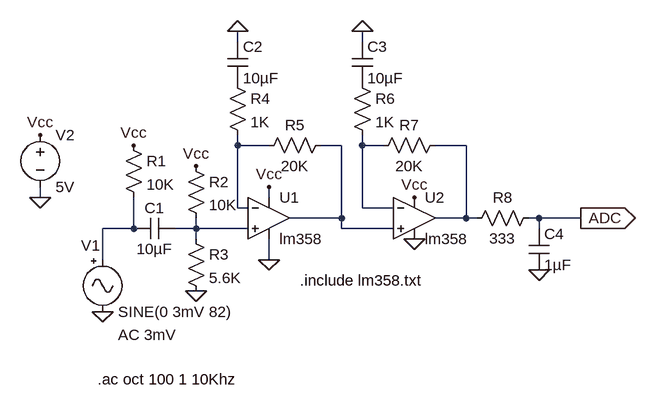
[diagram p0: schematic mic_amp_1.asc]
mic_amp_1.asc, the LTspice schematic file:
Version 4
SHEET 1 1348 680
WIRE 272 -192 272 -208
WIRE 464 -192 464 -208
WIRE 272 -32 272 -48
WIRE 320 -32 272 -32
WIRE 432 -32 400 -32
WIRE 464 -32 464 -48
WIRE 496 -32 464 -32
WIRE 624 -32 576 -32
WIRE -32 48 -32 32
WIRE 320 48 320 32
WIRE 272 64 272 -32
WIRE 288 64 272 64
WIRE 464 64 464 -32
WIRE 512 64 464 64
WIRE 432 80 432 -32
WIRE 432 80 352 80
WIRE 624 80 624 -32
WIRE 624 80 576 80
WIRE 640 80 624 80
WIRE 736 80 720 80
WIRE 800 80 736 80
WIRE 112 96 112 48
WIRE 112 96 64 96
WIRE 208 96 208 80
WIRE 208 96 176 96
WIRE 288 96 208 96
WIRE 432 96 432 80
WIRE 512 96 432 96
WIRE 736 96 736 80
WIRE 208 112 208 96
WIRE 64 144 64 96
WIRE 320 144 320 112
FLAG 64 224 0
FLAG -32 -48 Vcc
FLAG 112 -32 Vcc
FLAG 320 144 0
FLAG 320 32 Vcc
FLAG 544 112 0
FLAG 544 48 Vcc
FLAG 208 192 0
FLAG 208 0 Vcc
FLAG 272 -208 0
FLAG 464 -208 0
FLAG 736 160 0
FLAG 800 80 ADC
IOPIN 800 80 Out
FLAG -32 48 0
SYMBOL Misc\\signal 64 128 R0
WINDOW 123 24 132 Left 2
WINDOW 39 0 0 Left 0
WINDOW 0 -33 -6 Left 2
SYMATTR Value2 AC 3mV
SYMATTR InstName V1
SYMATTR Value SINE(0 3mV 82)
SYMBOL voltage -32 -64 R0
WINDOW 123 0 0 Left 0
WINDOW 39 0 0 Left 0
SYMATTR InstName V2
SYMATTR Value 5V
SYMBOL cap 176 80 R90
WINDOW 0 0 32 VBottom 2
WINDOW 3 32 32 VTop 2
SYMATTR InstName C1
SYMATTR Value 10µF
SYMBOL res 96 -48 R0
SYMATTR InstName R1
SYMATTR Value 10K
SYMBOL Opamps\\opamp2 320 16 R0
SYMATTR InstName U1
SYMATTR Value lm358
SYMBOL Opamps\\opamp2 544 16 R0
SYMATTR InstName U2
SYMATTR Value lm358
SYMBOL res 192 -16 R0
SYMATTR InstName R2
SYMATTR Value 10K
SYMBOL res 192 96 R0
SYMATTR InstName R3
SYMATTR Value 5.6K
SYMBOL res 256 -144 R0
SYMATTR InstName R4
SYMATTR Value 1K
SYMBOL res 416 -48 R90
WINDOW 0 0 56 VBottom 2
WINDOW 3 32 56 VTop 2
SYMATTR InstName R5
SYMATTR Value 20K
SYMBOL cap 256 -192 R0
SYMATTR InstName C2
SYMATTR Value 10µF
SYMBOL res 448 -144 R0
SYMATTR InstName R6
SYMATTR Value 1K
SYMBOL res 592 -48 R90
WINDOW 0 0 56 VBottom 2
WINDOW 3 32 56 VTop 2
SYMATTR InstName R7
SYMATTR Value 20K
SYMBOL cap 448 -192 R0
SYMATTR InstName C3
SYMATTR Value 10µF
SYMBOL res 736 64 R90
WINDOW 0 0 56 VBottom 2
WINDOW 3 32 56 VTop 2
SYMATTR InstName R8
SYMATTR Value 333
SYMBOL cap 720 96 R0
SYMATTR InstName C4
SYMATTR Value 1µF
TEXT 368 176 Left 2 !.include lm358.txt
TEXT 56 328 Left 2 !.ac oct 100 1 10Khz

The netlist it stands for:
* mic_amp_1.asc
V1 N005 0 SINE(0 3mV 82) AC 3mV
V2 Vcc 0 5V
C1 N006 N005 10µF
R1 Vcc N005 10K
XU1 N006 N001 Vcc 0 N002 lm358  ; pins In+ In- V+ V- OUT
XU2 N002 N003 Vcc 0 N004 lm358  ; pins In+ In- V+ V- OUT
R2 Vcc N006 10K
R3 N006 0 5.6K
R4 P001 N001 1K
R5 N002 N001 20K
C2 0 P001 10µF
R6 P002 N003 1K
R7 N004 N003 20K
C3 0 P002 10µF
R8 ADC N004 333
C4 ADC 0 1µF
.include lm358.txt
.ac oct 100 1 10Khz
.backanno
.end